# Altium project TransistorKeyBoard.PrjPcb
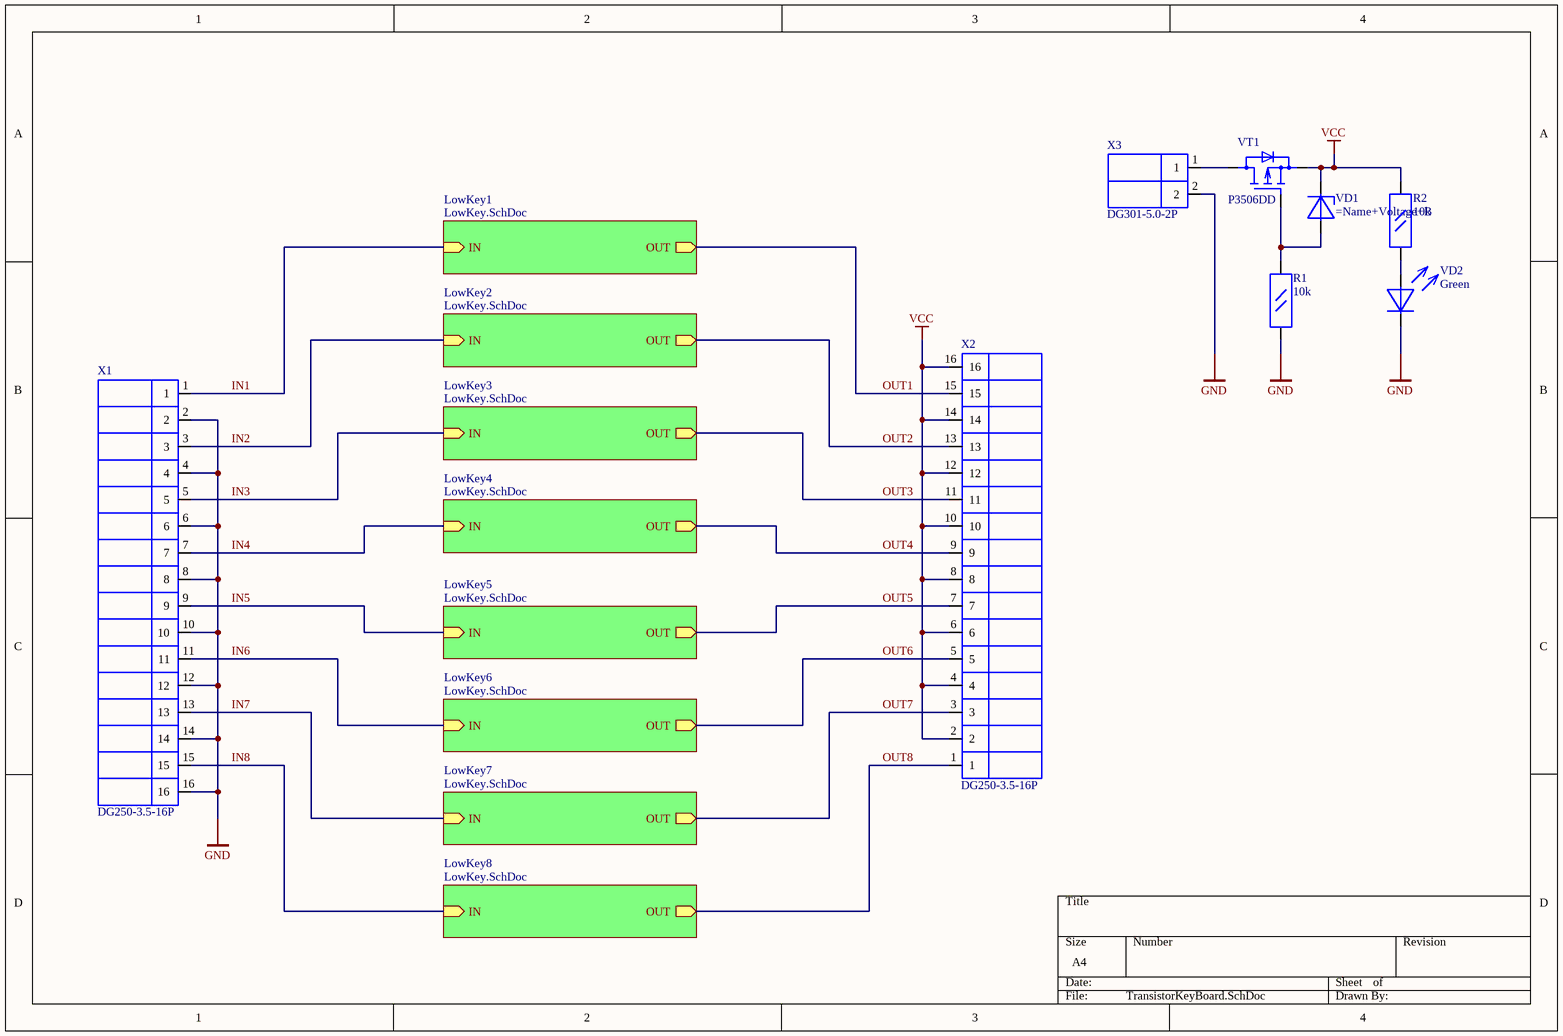
[diagram p0: TransistorKeyBoard.SchDoc]
2 sheets, 96 parts. Net scope: hierarchical (ports join the sheet entries above them; power ports are global).
Board file: TransistorKeyBoard.PcbDoc
Sheets:
  TransistorKeyBoard.SchDoc
    LowKey1 = LowKey.SchDoc
    LowKey2 = LowKey.SchDoc
    LowKey3 = LowKey.SchDoc
    LowKey4 = LowKey.SchDoc
    LowKey5 = LowKey.SchDoc
    LowKey6 = LowKey.SchDoc
    LowKey7 = LowKey.SchDoc
    LowKey8 = LowKey.SchDoc

## Sheet TransistorKeyBoard.SchDoc
size A4

### Parts
R1  Resistance (Ohms): 10k  [RES0805]  (hidden comment: R0805)
R2  Resistance (Ohms): 10k  [RES0805]  (hidden comment: R0805)
VD1  (no value)  [SOD323]
VD2  Color: Green  [3mm led green]  (hidden comment: Led Green 3mm)
VT1  P3506DD  [DPAK]
X1  DG250-3.5-16P  [DG250-3.5-16P]
X2  DG250-3.5-16P  [DG250-3.5-16P]
X3  DG301-5.0-2P  [DG301-5.0-2P]

### Sub-sheets
LowKey1 = LowKey.SchDoc: IN (in), OUT (out)
LowKey2 = LowKey.SchDoc: IN (in), OUT (out)
LowKey3 = LowKey.SchDoc: IN (in), OUT (out)
LowKey4 = LowKey.SchDoc: IN (in), OUT (out)
LowKey5 = LowKey.SchDoc: IN (in), OUT (out)
LowKey6 = LowKey.SchDoc: IN (in), OUT (out)
LowKey7 = LowKey.SchDoc: IN (in), OUT (out)
LowKey8 = LowKey.SchDoc: IN (in), OUT (out)

### Nets
GND: R1.1 VD2.1(C) X1.2 X1.4 X1.6 X1.8 X1.10 X1.12 X1.14 X1.16 X3.2
VCC: R2.2 VD1.1(C) VT1.3(S) X2.2 X2.4 X2.6 X2.8 X2.10 X2.12 X2.14 X2.16
IN1: X1.1 ; sheet LowKey1/IN
IN2: X1.3 ; sheet LowKey2/IN
IN3: X1.5 ; sheet LowKey3/IN
IN4: X1.7 ; sheet LowKey4/IN
IN5: X1.9 ; sheet LowKey5/IN
IN6: X1.11 ; sheet LowKey6/IN
IN7: X1.13 ; sheet LowKey7/IN
IN8: X1.15 ; sheet LowKey8/IN
OUT1: X2.15 ; sheet LowKey1/OUT
OUT2: X2.13 ; sheet LowKey2/OUT
OUT3: X2.11 ; sheet LowKey3/OUT
OUT4: X2.9 ; sheet LowKey4/OUT
OUT5: X2.7 ; sheet LowKey5/OUT
OUT6: X2.5 ; sheet LowKey6/OUT
OUT7: X2.3 ; sheet LowKey7/OUT
OUT8: X2.1 ; sheet LowKey8/OUT
NetR1_2: R1.2 VD1.2(A) VT1.1(G)
NetR2_1: R2.1 VD2.2(A)
NetVT1_2: VT1.2(D) X3.1

### Library data of the parts
R1 R2 = R0805: Resistor; Power (Watts): 1/8W; Package: 0805; Category: Resistors
VD1 = PDZ-B: Diode; Name: PDZ; Voltage: 12; Package: SOD323
VD2 = Led Green 3mm: 3mm Green Led 2.54pitch
VT1 = P3506DD: P-channel MOSFET transistor; Manufacturer: NIKO SEMICONDUCTOR CO; Package: D-PAK(TO-252); Name: P3506DD
X1 X2 = DG250-3.5-16P: 5mm Pitch PCB Terminal Block Connector; Manufacture: DEGSON; Name: DG250-3.5-16P; Pitch: 5mm
X3 = DG301-5.0-2P: 5mm Pitch PCB Terminal Block Connector; Manufacture: DEGSON; Name: DG301-5.0-2P; Pitch: 5mm

## Sheet LowKey.SchDoc
size A4
Used 8 times, as channels LowKey1, LowKey2, LowKey3, LowKey4, LowKey5, LowKey6, LowKey7, LowKey8. Parts and nets are listed once, with the designators drawn on the sheet.
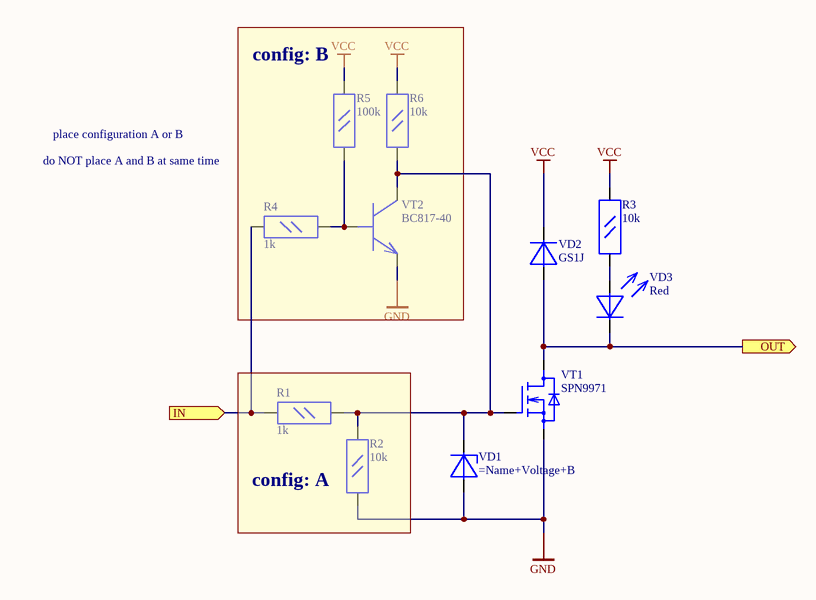
[diagram p1: LowKey.SchDoc]

### Parts
R1  Resistance (Ohms): 1k  [RES0805]  (hidden comment: R0805)
R2  Resistance (Ohms): 10k  [RES0805]  (hidden comment: R0805)
R3  Resistance (Ohms): 10k  [RES0805]  (hidden comment: R0805)
R4  Resistance (Ohms): 1k  [RES0805]  (hidden comment: R0805)
R5  Resistance (Ohms): 100k  [RES0805]  (hidden comment: R0805)
R6  Resistance (Ohms): 10k  [RES0805]  (hidden comment: R0805)
VD1  (no value)  [SOD323]
VD2  GS1J  [DO-214AC(SMA)]
VD3  Color: Red  [3mm led red]  (hidden comment: Led Red 3mm)
VT1  SPN9971  [DPAK]
VT2  BC817-40  [SOT95P230X110-3N]

### Blocks framed on the sheet
config: B: R4-R6 VT2
config: A: R1 R2

### Ports
IN (in), OUT (out)

### Nets
GND: R2.1 VD1.2(A) VT1.3(S) VT2.2(E)
VCC: R3.2 R5.2 R6.2 VD2.1(C)
IN: R1.1 R4.1 ; port IN
OUT: VD2.2(A) VD3.1(C) VT1.2(D) ; port OUT
NetR1_2: R1.2 R2.2 R6.1 VD1.1(C) VT1.1(G) VT2.3(C)
NetR3_1: R3.1 VD3.2(A)
NetR4_2: R4.2 R5.1 VT2.1(B)

### Channels
LowKey1: designators R1=1R1 R2=1R2 R3=1R3 R4=1R4 R5=1R5 R6=1R6 VD1=1VD1 VD2=1VD2 VD3=1VD3 VT1=1VT1 VT2=1VT2; ports IN=IN1 OUT=OUT1
LowKey2: designators R1=2R1 R2=2R2 R3=2R3 R4=2R4 R5=2R5 R6=2R6 VD1=2VD1 VD2=2VD2 VD3=2VD3 VT1=2VT1 VT2=2VT2; ports IN=IN2 OUT=OUT2
LowKey3: designators R1=3R1 R2=3R2 R3=3R3 R4=3R4 R5=3R5 R6=3R6 VD1=3VD1 VD2=3VD2 VD3=3VD3 VT1=3VT1 VT2=3VT2; ports IN=IN3 OUT=OUT3
LowKey4: designators R1=4R1 R2=4R2 R3=4R3 R4=4R4 R5=4R5 R6=4R6 VD1=4VD1 VD2=4VD2 VD3=4VD3 VT1=4VT1 VT2=4VT2; ports IN=IN4 OUT=OUT4
LowKey5: designators R1=5R1 R2=5R2 R3=5R3 R4=5R4 R5=5R5 R6=5R6 VD1=5VD1 VD2=5VD2 VD3=5VD3 VT1=5VT1 VT2=5VT2; ports IN=IN5 OUT=OUT5
LowKey6: designators R1=6R1 R2=6R2 R3=6R3 R4=6R4 R5=6R5 R6=6R6 VD1=6VD1 VD2=6VD2 VD3=6VD3 VT1=6VT1 VT2=6VT2; ports IN=IN6 OUT=OUT6
LowKey7: designators R1=7R1 R2=7R2 R3=7R3 R4=7R4 R5=7R5 R6=7R6 VD1=7VD1 VD2=7VD2 VD3=7VD3 VT1=7VT1 VT2=7VT2; ports IN=IN7 OUT=OUT7
LowKey8: designators R1=8R1 R2=8R2 R3=8R3 R4=8R4 R5=8R5 R6=8R6 VD1=8VD1 VD2=8VD2 VD3=8VD3 VT1=8VT1 VT2=8VT2; ports IN=IN8 OUT=OUT8

### Notes on the sheet
- place configuration A or B
- do NOT place A and B at same time

### Library data of the parts
R1-R6 = R0805: Resistor; Power (Watts): 1/8W; Package: 0805; Category: Resistors
VD1 = PDZ-B: Diode; Name: PDZ; Voltage: 12; Package: SOD323
VD2 = GS1J: 1.0A Surface Mount Standard Diode; Manufacturer: WTE; Voltage: 600V; Name: GS1J; Package: SMA(DO-214AC)
VD3 = Led Red 3mm: 3mm Red Led 2.54pitch
VT1 = SPN9971: N-channel MOSFET transistor; Package: DPAK; Name: SPN9971
VT2 = BC817-40: NPN bipolar transistor; Package: SOT23; Name: BC817-40

## Nets that join several sheets
GND: TransistorKeyBoard (11 pins), LowKey1 (1R2.1 1VD1.2 1VT1.3 1VT2.2), LowKey2 (2R2.1 2VD1.2 2VT1.3 2VT2.2), LowKey3 (3R2.1 3VD1.2 3VT1.3 3VT2.2), LowKey4 (4R2.1 4VD1.2 4VT1.3 4VT2.2), LowKey5 (5R2.1 5VD1.2 5VT1.3 5VT2.2), LowKey6 (6R2.1 6VD1.2 6VT1.3 6VT2.2), LowKey7 (7R2.1 7VD1.2 7VT1.3 7VT2.2), LowKey8 (8R2.1 8VD1.2 8VT1.3 8VT2.2)
VCC: TransistorKeyBoard (11 pins), LowKey1 (1R3.2 1R5.2 1R6.2 1VD2.1), LowKey2 (2R3.2 2R5.2 2R6.2 2VD2.1), LowKey3 (3R3.2 3R5.2 3R6.2 3VD2.1), LowKey4 (4R3.2 4R5.2 4R6.2 4VD2.1), LowKey5 (5R3.2 5R5.2 5R6.2 5VD2.1), LowKey6 (6R3.2 6R5.2 6R6.2 6VD2.1), LowKey7 (7R3.2 7R5.2 7R6.2 7VD2.1), LowKey8 (8R3.2 8R5.2 8R6.2 8VD2.1)
IN1: TransistorKeyBoard (X1.1), LowKey1 (1R1.1 1R4.1)
IN2: TransistorKeyBoard (X1.3), LowKey2 (2R1.1 2R4.1)
IN3: TransistorKeyBoard (X1.5), LowKey3 (3R1.1 3R4.1)
IN4: TransistorKeyBoard (X1.7), LowKey4 (4R1.1 4R4.1)
IN5: TransistorKeyBoard (X1.9), LowKey5 (5R1.1 5R4.1)
IN6: TransistorKeyBoard (X1.11), LowKey6 (6R1.1 6R4.1)
IN7: TransistorKeyBoard (X1.13), LowKey7 (7R1.1 7R4.1)
IN8: TransistorKeyBoard (X1.15), LowKey8 (8R1.1 8R4.1)
OUT1: TransistorKeyBoard (X2.15), LowKey1 (1VD2.2 1VD3.1 1VT1.2)
OUT2: TransistorKeyBoard (X2.13), LowKey2 (2VD2.2 2VD3.1 2VT1.2)
OUT3: TransistorKeyBoard (X2.11), LowKey3 (3VD2.2 3VD3.1 3VT1.2)
OUT4: TransistorKeyBoard (X2.9), LowKey4 (4VD2.2 4VD3.1 4VT1.2)
OUT5: TransistorKeyBoard (X2.7), LowKey5 (5VD2.2 5VD3.1 5VT1.2)
OUT6: TransistorKeyBoard (X2.5), LowKey6 (6VD2.2 6VD3.1 6VT1.2)
OUT7: TransistorKeyBoard (X2.3), LowKey7 (7VD2.2 7VD3.1 7VT1.2)
OUT8: TransistorKeyBoard (X2.1), LowKey8 (8VD2.2 8VD3.1 8VT1.2)